# EasyEDA Pro project Motor Controller STM32.eprj

# Schematic MP2307 Module
Board Name: Board1; Create Date: 2025-07-21; Page Name: Power & Protection; Project Name: Motor Controller STM32; Schematic Name: MP2307 Module; Update Date: 2025-07-21; Company: EasyEDA.com; Page Size: A4; Version: V1.0
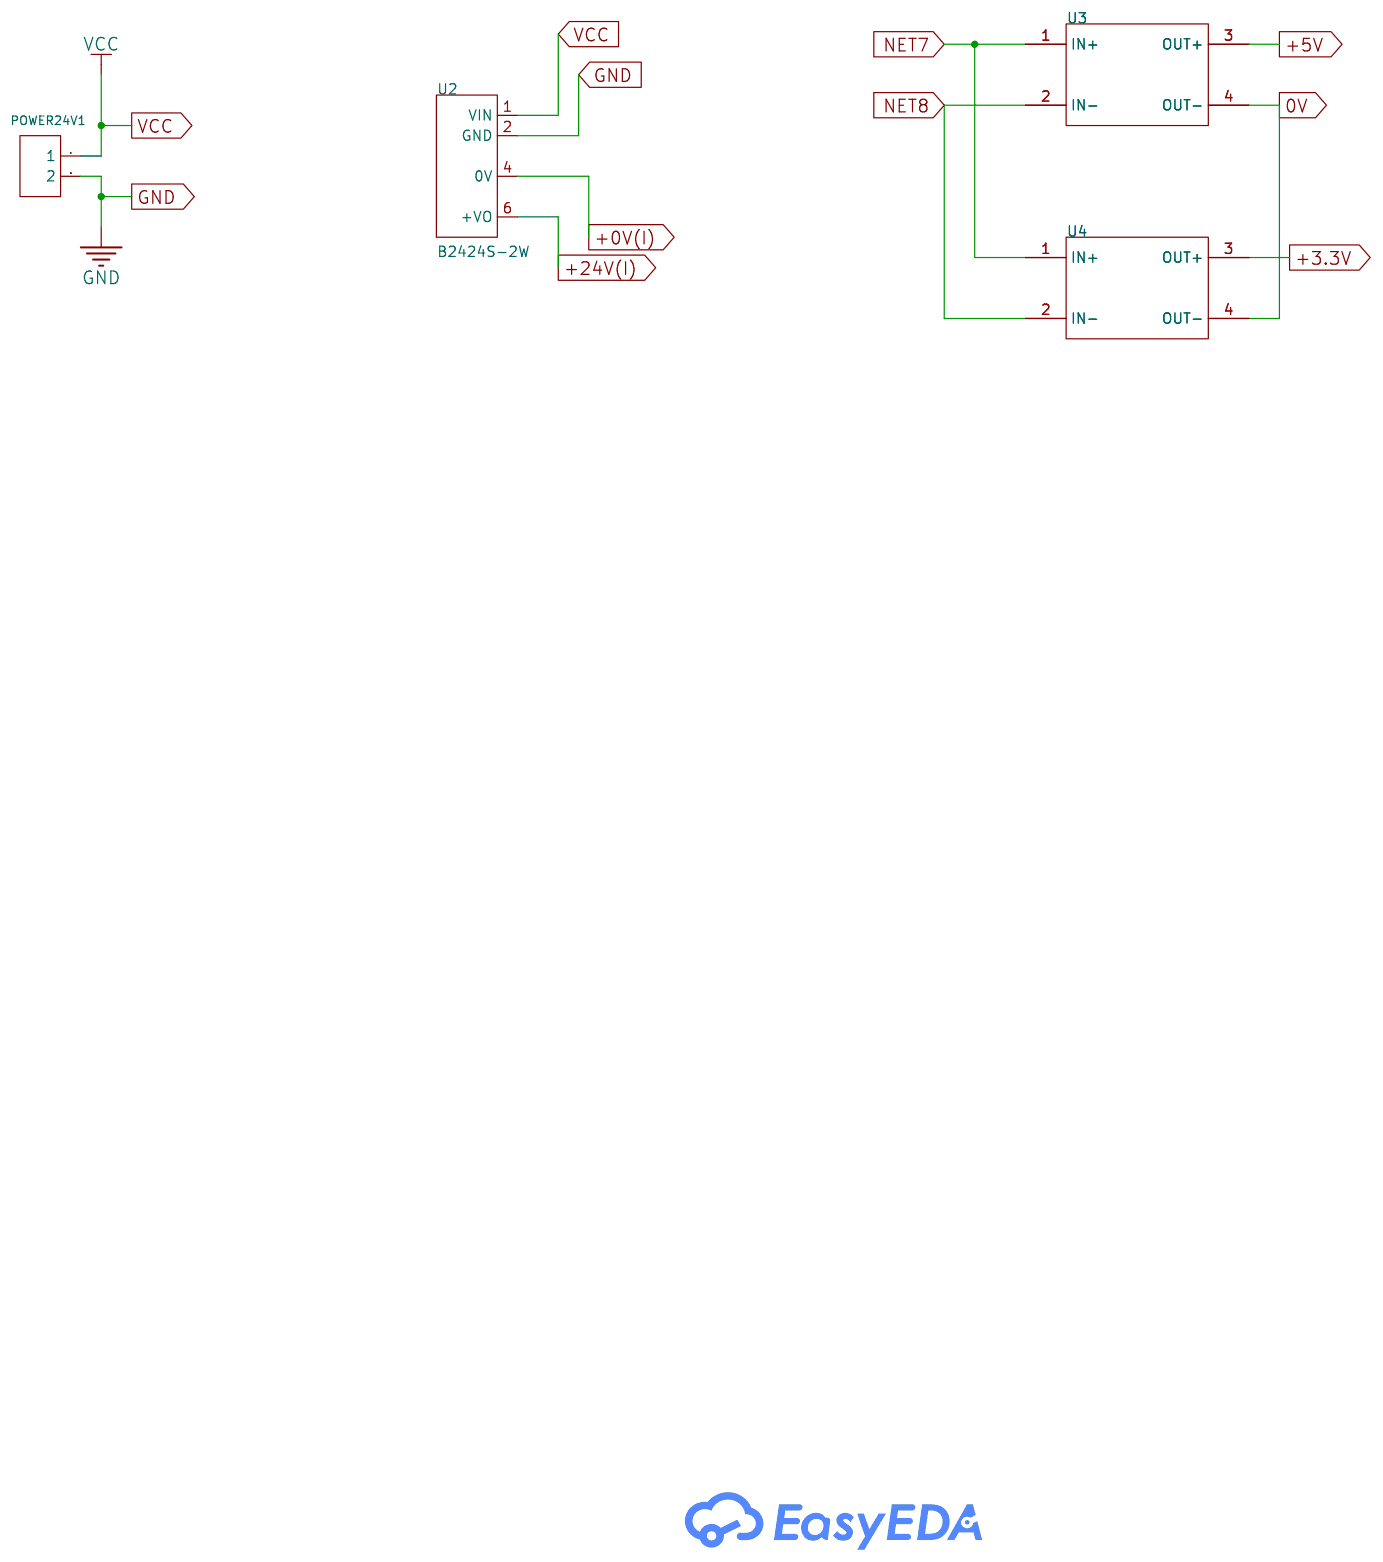
[diagram p0: schematic sheet]

## Parts
POWER24V1  -  [HDR-TH_2P-P2.54-V-F]
U2  B2424S-2W  [PWRM-TH_BXXXXS-2W]
U3  -  [MINI 360]
U4  -  [MINI 360]

## Library data of the parts
POWER24V1 = HDR-F_2.54_1x2P: Supplier Footprint: Through
U2 = B2424S-2W_C442555: Supplier Part: C442555; Manufacturer: JETEKPS(健特); Supplier Footprint: SIP,19.6x7mm; JLCPCB Part Class: Extended Part; Datasheet: https://atta.szlcsc.com/upload/public/pdf/source/20191030/C442555_72EDD6DD5B97F2F98EAB70AD27CE1320.pdf; Supplier: LCSC; Number of Channels: 1; Output Power: 2W; Voltage - Supply: 21.6V~26.4V; Conversion Efficiency: 89%; Output Voltage: 24V; Output Current(Max): 83mA; Capacitive Load(Max): 1000uF; Isolation Voltage(Vrms): 1500V; Operating Temperature: -40℃~+85℃
U3 U4 = Buck Converter Mini 360

## Nets
0V: U3.4(OUT-) U4.4(OUT-)
+0V(I): U2.4(0V)
+3.3V: U4.3(OUT+)
+5V: U3.3(OUT+)
+24V(I): U2.6(+VO)
GND: POWER24V1.2 U2.2(GND)
VCC: POWER24V1.1 U2.1(VIN)
NET7: U3.1(IN+) U4.1(IN+)
NET8: U3.2(IN-) U4.2(IN-)
